# Altium schematic sheet CON_PWMx4_KMRJIO3_5MM_6WAY.SchDoc: Screw Header For Power PWM
size A4; Organization: Altium Limited.; Address1: Level 3, 12a Rodborough Rd; Address2: Frenchs Forest 2086; Address3: NSW; Address4: AUSTRALIA; DocumentNumber: 12; SheetNumber: 13; SheetTotal: 77
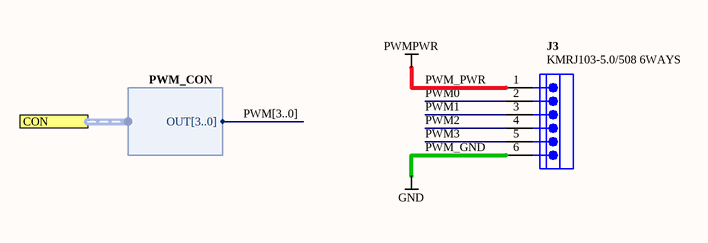
[diagram p0: CON_PWMx4_KMRJIO3_5MM_6WAY.SchDoc]

## Parts
J3  KMRJ103-5.0/508 6WAYS  [KMRJ103-5-508-6]

## Ports
CON (harness PWM_CON)

## Harnesses
PWM_CON: OUT[3..0]

## Nets
PWM_GND: J3.6  [also labelled GND]
PWM_PWR: J3.1  [also labelled PWMPWR]
PWM0: J3.2
PWM1: J3.3
PWM2: J3.4
PWM3: J3.5

## Buses and harness runs
bus PWM[3..0]

## Notes on the sheet
- Sheet Title
- Project Title
- Size:
- Date:
- A4
- Assy:
- Time:
- Revision:
- Sheet
- of
- File:

## Library data of the parts
J3 = D-300-0122: Socket, Screw Terminal Block, 6 Way, 5.0mm pitch, 45 degree angle, Through-hole; Connector type: Header; Max Current: 300V/10A A; Mounting Technology: Through-Hole; Pin Count: 6; Status: Unreleased; Category: Connector